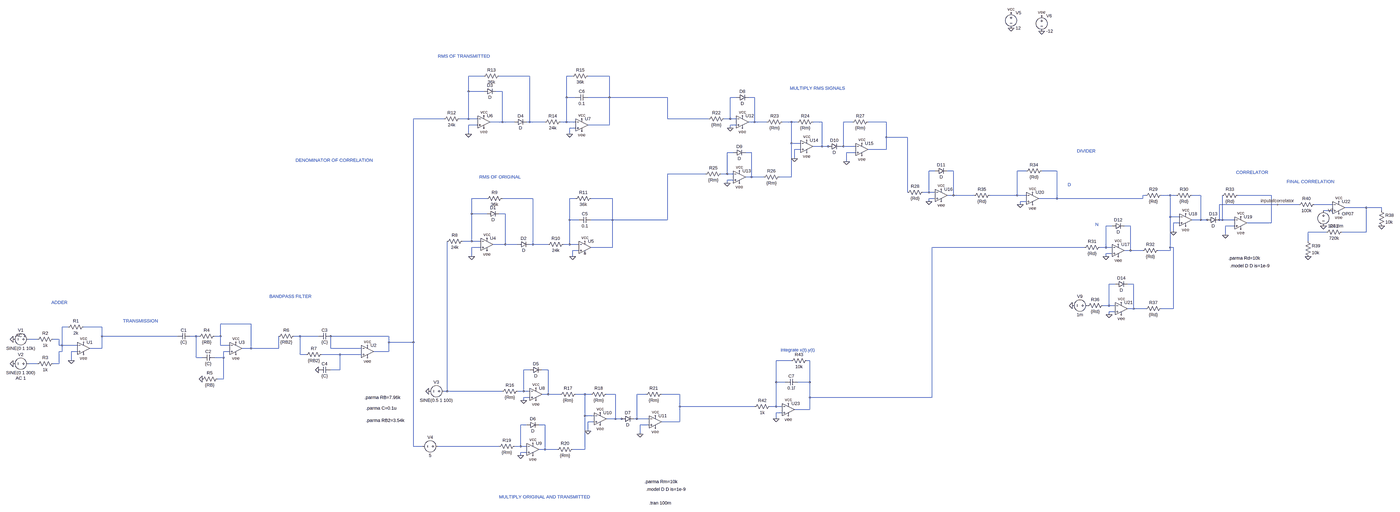
[diagram p0: schematic CORRELATOR BASE.asc, whole sheet]
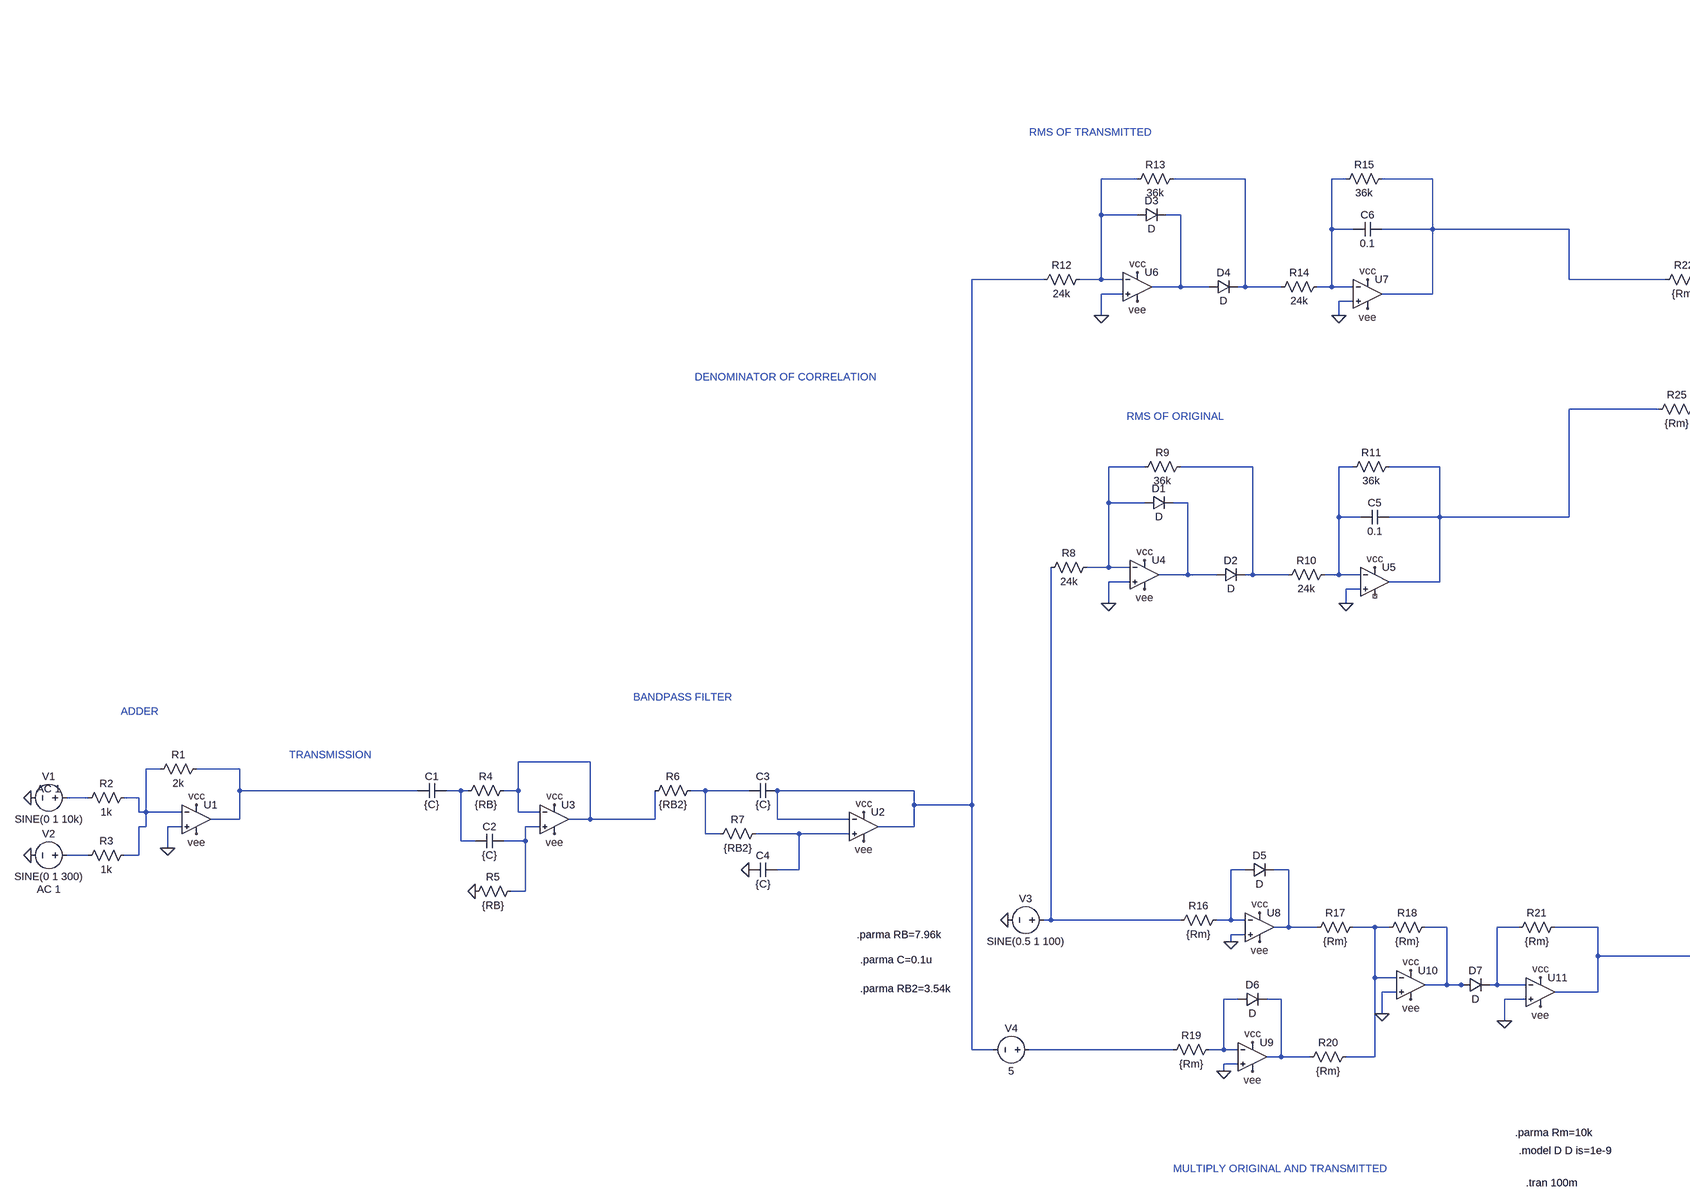
[diagram p1: schematic CORRELATOR BASE.asc, part, row 1 of 1, column 1 of 2]
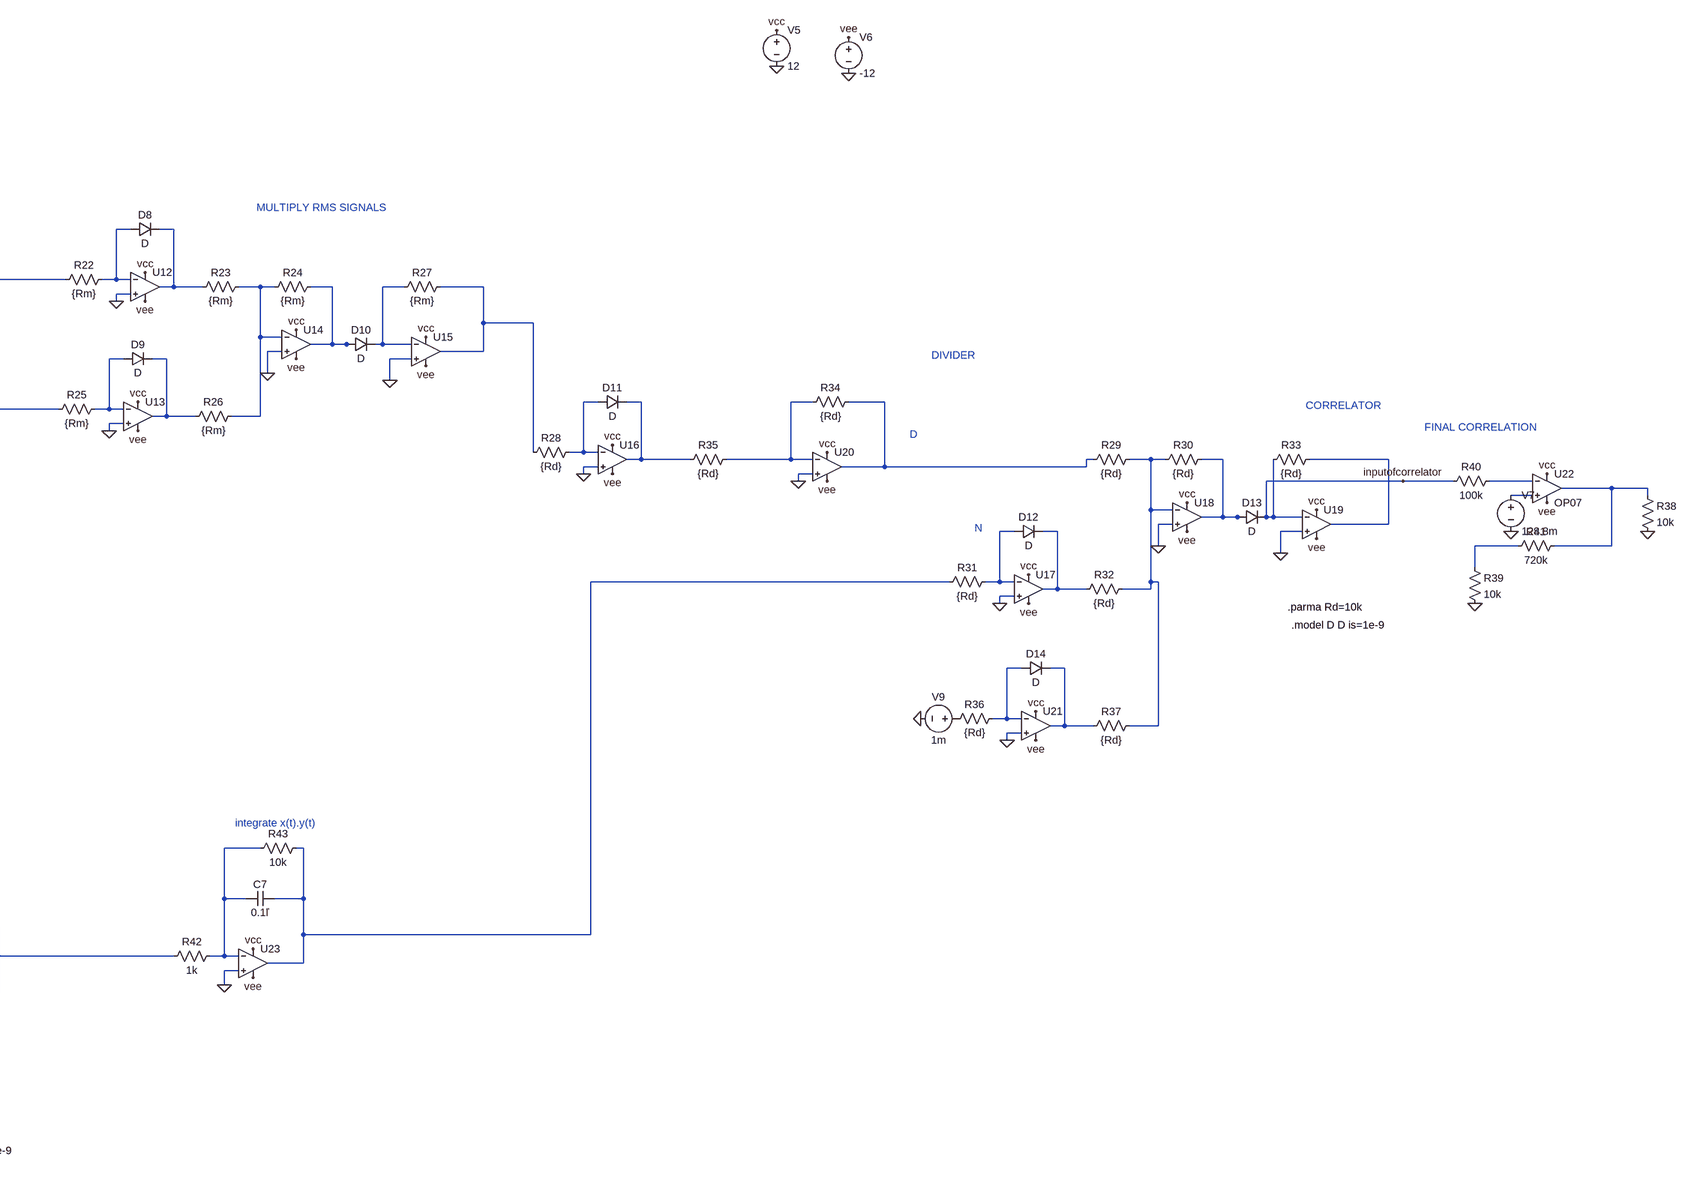
[diagram p2: schematic CORRELATOR BASE.asc, part, row 1 of 1, column 2 of 2]
CORRELATOR BASE.asc, the LTspice schematic file:
Version 4
SHEET 1 8324 1016
WIRE 2640 -1392 2560 -1392
WIRE 2880 -1392 2720 -1392
WIRE 3104 -1392 3072 -1392
WIRE 3296 -1392 3184 -1392
WIRE 2560 -1312 2560 -1392
WIRE 2640 -1312 2560 -1312
WIRE 2736 -1312 2704 -1312
WIRE 3072 -1280 3072 -1392
WIRE 3120 -1280 3072 -1280
WIRE 3296 -1280 3296 -1392
WIRE 3296 -1280 3184 -1280
WIRE 3600 -1280 3296 -1280
WIRE 4064 -1280 4032 -1280
WIRE 4160 -1280 4128 -1280
WIRE 2432 -1168 2272 -1168
WIRE 2560 -1168 2560 -1312
WIRE 2560 -1168 2512 -1168
WIRE 2608 -1168 2560 -1168
WIRE 3600 -1168 3600 -1280
WIRE 3920 -1168 3600 -1168
WIRE 4032 -1168 4032 -1280
WIRE 4032 -1168 4000 -1168
WIRE 4064 -1168 4032 -1168
WIRE 2736 -1152 2736 -1312
WIRE 2736 -1152 2672 -1152
WIRE 2800 -1152 2736 -1152
WIRE 2880 -1152 2880 -1392
WIRE 2880 -1152 2864 -1152
WIRE 2960 -1152 2880 -1152
WIRE 3072 -1152 3072 -1280
WIRE 3072 -1152 3040 -1152
WIRE 3120 -1152 3072 -1152
WIRE 4160 -1152 4160 -1280
WIRE 4160 -1152 4128 -1152
WIRE 4224 -1152 4160 -1152
WIRE 4352 -1152 4304 -1152
WIRE 4384 -1152 4352 -1152
WIRE 4512 -1152 4464 -1152
WIRE 4672 -1152 4624 -1152
WIRE 4848 -1152 4752 -1152
WIRE 2608 -1136 2560 -1136
WIRE 3296 -1136 3296 -1280
WIRE 3296 -1136 3184 -1136
WIRE 4064 -1136 4032 -1136
WIRE 3120 -1120 3088 -1120
WIRE 4032 -1120 4032 -1136
WIRE 2560 -1088 2560 -1136
WIRE 3088 -1088 3088 -1120
WIRE 4848 -1072 4848 -1152
WIRE 5072 -1072 4848 -1072
WIRE 4352 -1040 4352 -1152
WIRE 4400 -1040 4352 -1040
WIRE 4512 -1024 4512 -1152
WIRE 4512 -1024 4464 -1024
WIRE 4544 -1024 4512 -1024
WIRE 4560 -1024 4544 -1024
WIRE 4624 -1024 4624 -1152
WIRE 4624 -1024 4608 -1024
WIRE 4688 -1024 4624 -1024
WIRE 4400 -1008 4368 -1008
WIRE 4848 -1008 4848 -1072
WIRE 4848 -1008 4752 -1008
WIRE 4048 -992 4016 -992
WIRE 4144 -992 4112 -992
WIRE 4688 -992 4640 -992
WIRE 4368 -960 4368 -1008
WIRE 4640 -944 4640 -992
WIRE 5216 -896 5184 -896
WIRE 5312 -896 5280 -896
WIRE 5728 -896 5680 -896
WIRE 5888 -896 5808 -896
WIRE 3904 -880 3600 -880
WIRE 4016 -880 4016 -992
WIRE 4016 -880 3984 -880
WIRE 4048 -880 4016 -880
WIRE 4144 -864 4144 -992
WIRE 4144 -864 4112 -864
WIRE 4208 -864 4144 -864
WIRE 4352 -864 4352 -1040
WIRE 4352 -864 4288 -864
WIRE 4048 -848 4016 -848
WIRE 4016 -832 4016 -848
WIRE 5072 -784 5072 -1072
WIRE 5184 -784 5184 -896
WIRE 5184 -784 5152 -784
WIRE 5216 -784 5184 -784
WIRE 5312 -768 5312 -896
WIRE 5312 -768 5280 -768
WIRE 5456 -768 5312 -768
WIRE 5680 -768 5680 -896
WIRE 5680 -768 5536 -768
WIRE 5728 -768 5680 -768
WIRE 6352 -768 6336 -768
WIRE 6480 -768 6432 -768
WIRE 6512 -768 6480 -768
WIRE 6640 -768 6592 -768
WIRE 7008 -768 6832 -768
WIRE 2656 -752 2576 -752
WIRE 2896 -752 2736 -752
WIRE 3120 -752 3088 -752
WIRE 3312 -752 3200 -752
WIRE 5216 -752 5184 -752
WIRE 5888 -752 5888 -896
WIRE 5888 -752 5792 -752
WIRE 6336 -752 6336 -768
WIRE 6336 -752 5888 -752
WIRE 5184 -736 5184 -752
WIRE 5728 -736 5696 -736
WIRE 5696 -720 5696 -736
WIRE 7040 -720 6736 -720
WIRE 7152 -720 7040 -720
WIRE 7328 -720 7232 -720
WIRE 7504 -704 7392 -704
WIRE 7584 -704 7504 -704
WIRE 7328 -688 7280 -688
WIRE 7584 -688 7584 -704
WIRE 2576 -672 2576 -752
WIRE 2656 -672 2576 -672
WIRE 2752 -672 2720 -672
WIRE 6480 -656 6480 -768
WIRE 6528 -656 6480 -656
WIRE 3088 -640 3088 -752
WIRE 3136 -640 3088 -640
WIRE 3312 -640 3312 -752
WIRE 3312 -640 3200 -640
WIRE 3600 -640 3600 -880
WIRE 3600 -640 3312 -640
WIRE 6640 -640 6640 -768
WIRE 6640 -640 6592 -640
WIRE 6672 -640 6640 -640
WIRE 6688 -640 6672 -640
WIRE 6736 -640 6736 -720
WIRE 6752 -640 6752 -768
WIRE 6752 -640 6736 -640
WIRE 6816 -640 6752 -640
WIRE 6528 -624 6496 -624
WIRE 7008 -624 7008 -768
WIRE 7008 -624 6880 -624
WIRE 6176 -608 6144 -608
WIRE 6272 -608 6240 -608
WIRE 6816 -608 6768 -608
WIRE 6496 -576 6496 -624
WIRE 7296 -576 7200 -576
WIRE 7504 -576 7504 -704
WIRE 7504 -576 7376 -576
WIRE 6768 -560 6768 -608
WIRE 2576 -528 2576 -672
WIRE 2576 -528 2528 -528
WIRE 2624 -528 2576 -528
WIRE 7200 -528 7200 -576
WIRE 2752 -512 2752 -672
WIRE 2752 -512 2688 -512
WIRE 2816 -512 2752 -512
WIRE 2896 -512 2896 -752
WIRE 2896 -512 2880 -512
WIRE 2976 -512 2896 -512
WIRE 3088 -512 3088 -640
WIRE 3088 -512 3056 -512
WIRE 3136 -512 3088 -512
WIRE 2624 -496 2576 -496
WIRE 3312 -496 3312 -640
WIRE 3312 -496 3200 -496
WIRE 6032 -496 5200 -496
WIRE 6144 -496 6144 -608
WIRE 6144 -496 6112 -496
WIRE 6176 -496 6144 -496
WIRE 6480 -496 6480 -656
WIRE 6496 -496 6480 -496
WIRE 3136 -480 3104 -480
WIRE 6272 -480 6272 -608
WIRE 6272 -480 6240 -480
WIRE 6336 -480 6272 -480
WIRE 6480 -480 6480 -496
WIRE 6480 -480 6416 -480
WIRE 6176 -464 6144 -464
WIRE 2576 -448 2576 -496
WIRE 3104 -448 3104 -480
WIRE 6144 -448 6144 -464
WIRE 6192 -304 6160 -304
WIRE 6288 -304 6256 -304
WIRE 6160 -192 6160 -304
WIRE 6160 -192 6128 -192
WIRE 6192 -192 6160 -192
WIRE 6288 -176 6288 -304
WIRE 6288 -176 6256 -176
WIRE 6352 -176 6288 -176
WIRE 6496 -176 6496 -496
WIRE 6496 -176 6432 -176
WIRE 6192 -160 6160 -160
WIRE 6160 -144 6160 -160
WIRE 1424 -96 1264 -96
WIRE 240 -80 208 -80
WIRE 416 -80 320 -80
WIRE 416 -32 416 -80
WIRE 1040 -32 416 -32
WIRE 1136 -32 1104 -32
WIRE 1152 -32 1136 -32
WIRE 1264 -32 1264 -96
WIRE 1264 -32 1232 -32
WIRE 1680 -32 1648 -32
WIRE 1776 -32 1680 -32
WIRE 2144 -32 1840 -32
WIRE 80 -16 32 -16
WIRE 192 -16 160 -16
WIRE 2144 0 2144 -32
WIRE 2272 0 2272 -1168
WIRE 2272 0 2144 0
WIRE 192 16 192 -16
WIRE 208 16 208 -80
WIRE 208 16 192 16
WIRE 288 16 208 16
WIRE 1264 16 1264 -32
WIRE 1312 16 1264 16
WIRE 416 32 416 -32
WIRE 416 32 352 32
WIRE 1424 32 1424 -96
WIRE 1424 32 1376 32
WIRE 1568 32 1568 -32
WIRE 1568 32 1424 32
WIRE 1840 32 1840 -32
WIRE 2000 32 1840 32
WIRE 208 48 208 16
WIRE 208 48 192 48
WIRE 288 48 256 48
WIRE 1312 48 1280 48
WIRE 2144 48 2144 0
WIRE 2144 48 2064 48
WIRE 1680 64 1680 -32
WIRE 1712 64 1680 64
WIRE 1888 64 1792 64
WIRE 2000 64 1888 64
WIRE 1136 80 1136 -32
WIRE 1168 80 1136 80
WIRE 1280 80 1280 48
WIRE 1280 80 1232 80
WIRE 256 96 256 48
WIRE 4352 96 4272 96
WIRE 4448 96 4432 96
WIRE 80 112 32 112
WIRE 192 112 192 48
WIRE 192 112 160 112
WIRE 1888 144 1888 64
WIRE 1888 144 1840 144
WIRE 2880 144 2848 144
WIRE 2976 144 2944 144
WIRE 1280 192 1280 80
WIRE 1280 192 1248 192
WIRE 4272 208 4272 96
WIRE 4320 208 4272 208
WIRE 4448 208 4448 96
WIRE 4448 208 4384 208
WIRE 2448 256 2448 -528
WIRE 2448 256 2432 256
WIRE 2736 256 2448 256
WIRE 2848 256 2848 144
WIRE 2848 256 2816 256
WIRE 2880 256 2848 256
WIRE 2976 272 2976 144
WIRE 2976 272 2944 272
WIRE 3040 272 2976 272
WIRE 3168 272 3120 272
WIRE 3200 272 3168 272
WIRE 3328 272 3280 272
WIRE 3488 272 3440 272
WIRE 3664 272 3568 272
WIRE 2880 288 2848 288
WIRE 4448 288 4448 208
WIRE 5200 288 5200 -496
WIRE 5200 288 4448 288
WIRE 2848 304 2848 288
WIRE 3664 336 3664 272
WIRE 4160 336 3664 336
WIRE 4272 336 4272 208
WIRE 4272 336 4240 336
WIRE 4304 336 4272 336
WIRE 4448 352 4448 288
WIRE 4448 352 4368 352
WIRE 4304 368 4272 368
WIRE 3168 384 3168 272
WIRE 3216 384 3168 384
WIRE 3328 400 3328 272
WIRE 3328 400 3280 400
WIRE 3360 400 3328 400
WIRE 3376 400 3360 400
WIRE 3440 400 3440 272
WIRE 3440 400 3424 400
WIRE 3504 400 3440 400
WIRE 4272 400 4272 368
WIRE 3216 416 3184 416
WIRE 3664 416 3664 336
WIRE 3664 416 3568 416
WIRE 2864 432 2832 432
WIRE 2960 432 2928 432
WIRE 3504 432 3456 432
WIRE 3184 464 3184 416
WIRE 3456 480 3456 432
WIRE 2272 544 2272 0
WIRE 2320 544 2272 544
WIRE 2720 544 2400 544
WIRE 2832 544 2832 432
WIRE 2832 544 2800 544
WIRE 2864 544 2832 544
WIRE 2960 560 2960 432
WIRE 2960 560 2928 560
WIRE 3024 560 2960 560
WIRE 3168 560 3168 384
WIRE 3168 560 3104 560
WIRE 2864 576 2832 576
WIRE 2832 592 2832 576
FLAG 320 0 vcc
FLAG 320 64 vee
FLAG -48 -16 0
FLAG -48 112 0
FLAG 256 96 0
FLAG 2032 16 vcc
FLAG 2032 80 vee
FLAG 1168 192 0
FLAG 1776 144 0
FLAG 1344 0 vcc
FLAG 1344 64 vee
FLAG 2656 -544 vcc
FLAG 2656 -480 vee
FLAG 3168 -528 vcc
FLAG 3104 -448 0
FLAG 2576 -448 0
FLAG 2640 -1184 vcc
FLAG 2640 -1120 vee
FLAG 3152 -1168 vcc
FLAG 3152 -1104 vee
FLAG 3088 -1088 0
FLAG 2560 -1088 0
FLAG 2912 240 vcc
FLAG 2912 304 vee
FLAG 2848 304 0
FLAG 2896 528 vcc
FLAG 2896 592 vee
FLAG 2832 592 0
FLAG 3248 368 vcc
FLAG 3248 432 vee
FLAG 3536 384 vcc
FLAG 3536 448 vee
FLAG 3184 464 0
FLAG 3456 480 0
FLAG 2352 256 0
FLAG 4096 -1184 vcc
FLAG 4096 -1120 vee
FLAG 4032 -1120 0
FLAG 4080 -896 vcc
FLAG 4080 -832 vee
FLAG 4016 -832 0
FLAG 4432 -1056 vcc
FLAG 4432 -992 vee
FLAG 4720 -1040 vcc
FLAG 4720 -976 vee
FLAG 4368 -960 0
FLAG 4640 -944 0
FLAG 5248 -800 vcc
FLAG 5248 -736 vee
FLAG 5184 -736 0
FLAG 6208 -512 vcc
FLAG 6208 -448 vee
FLAG 6144 -448 0
FLAG 6560 -672 vcc
FLAG 6560 -608 vee
FLAG 6848 -656 vcc
FLAG 6848 -592 vee
FLAG 6496 -576 0
FLAG 6768 -560 0
FLAG 5760 -784 vcc
FLAG 5760 -720 vee
FLAG 6224 -208 vcc
FLAG 6224 -144 vee
FLAG 6160 -144 0
FLAG 5968 -192 0
FLAG 7360 -736 vcc
FLAG 7360 -672 vee
FLAG 7200 -448 0
FLAG 7584 -608 0
FLAG 7280 -608 0
FLAG 4336 320 vcc
FLAG 4336 384 vee
FLAG 4272 400 0
FLAG 5696 -720 0
FLAG 7040 -720 inputofcorrelator
FLAG 5648 -1744 0
FLAG 5808 -1728 0
FLAG 5648 -1824 vcc
FLAG 5808 -1808 vee
SYMBOL OpAmps\\UniversalOpAmp 320 32 R0
SYMATTR InstName U1
SYMATTR Value2 Avol=100k GBW=1Meg Vos=0
SYMBOL voltage 48 -16 R90
WINDOW 0 -32 56 VBottom 2
WINDOW 3 32 56 VTop 2
WINDOW 123 -4 56 VBottom 2
WINDOW 39 0 0 Left 0
SYMATTR InstName V1
SYMATTR Value SINE(0 1 10k)
SYMATTR Value2 AC 1
SYMBOL voltage 48 112 R90
WINDOW 0 -32 56 VBottom 2
WINDOW 3 32 56 VTop 2
WINDOW 123 60 56 VTop 2
WINDOW 39 0 0 Left 0
SYMATTR InstName V2
SYMATTR Value SINE(0 1 300)
SYMATTR Value2 AC 1
SYMBOL res 336 -96 R90
WINDOW 0 0 56 VBottom 2
WINDOW 3 32 56 VTop 2
SYMATTR InstName R1
SYMATTR Value 2k
SYMBOL res 176 -32 R90
WINDOW 0 0 56 VBottom 2
WINDOW 3 32 56 VTop 2
SYMATTR InstName R2
SYMATTR Value 1k
SYMBOL res 176 96 R90
WINDOW 0 0 56 VBottom 2
WINDOW 3 32 56 VTop 2
SYMATTR InstName R3
SYMATTR Value 1k
SYMBOL OpAmps\\UniversalOpAmp 2032 48 R0
SYMATTR InstName U2
SYMATTR Value2 Avol=100k GBW=1Meg Vos=0
SYMBOL cap 1104 -48 R90
WINDOW 0 0 32 VBottom 2
WINDOW 3 32 32 VTop 2
SYMATTR InstName C1
SYMATTR Value {C}
SYMBOL cap 1232 64 R90
WINDOW 0 0 32 VBottom 2
WINDOW 3 32 32 VTop 2
SYMATTR InstName C2
SYMATTR Value {C}
SYMBOL cap 1840 -48 R90
WINDOW 0 0 32 VBottom 2
WINDOW 3 32 32 VTop 2
SYMATTR InstName C3
SYMATTR Value {C}
SYMBOL cap 1840 128 R90
WINDOW 0 0 32 VBottom 2
WINDOW 3 32 32 VTop 2
SYMATTR InstName C4
SYMATTR Value {C}
SYMBOL res 1248 -48 R90
WINDOW 0 0 56 VBottom 2
WINDOW 3 32 56 VTop 2
SYMATTR InstName R4
SYMATTR Value {RB}
SYMBOL res 1264 176 R90
WINDOW 0 0 56 VBottom 2
WINDOW 3 32 56 VTop 2
SYMATTR InstName R5
SYMATTR Value {RB}
SYMBOL res 1664 -48 R90
WINDOW 0 0 56 VBottom 2
WINDOW 3 32 56 VTop 2
SYMATTR InstName R6
SYMATTR Value {RB2}
SYMBOL res 1808 48 R90
WINDOW 0 0 56 VBottom 2
WINDOW 3 32 56 VTop 2
SYMATTR InstName R7
SYMATTR Value {RB2}
SYMBOL OpAmps\\UniversalOpAmp 1344 32 R0
SYMATTR InstName U3
SYMATTR Value2 Avol=100k GBW=1Meg Vos=0
SYMBOL OpAmps\\UniversalOpAmp 2656 -512 R0
SYMATTR InstName U4
SYMATTR Value2 Avol=10k GBW=1Meg Vos=0
SYMBOL OpAmps\\UniversalOpAmp 3168 -496 R0
SYMATTR InstName U5
SYMATTR Value2 Avol=10k GBW=1Meg Vos=0
SYMBOL res 2544 -544 R90
WINDOW 0 0 56 VBottom 2
WINDOW 3 32 56 VTop 2
SYMATTR InstName R8
SYMATTR Value 24k
SYMBOL res 2752 -768 R90
WINDOW 0 0 56 VBottom 2
WINDOW 3 32 56 VTop 2
SYMATTR InstName R9
SYMATTR Value 36k
SYMBOL res 3072 -528 R90
WINDOW 0 0 56 VBottom 2
WINDOW 3 32 56 VTop 2
SYMATTR InstName R10
SYMATTR Value 24k
SYMBOL diode 2656 -656 R270
WINDOW 0 32 32 VTop 2
WINDOW 3 0 32 VBottom 2
SYMATTR InstName D1
SYMBOL diode 2816 -496 R270
WINDOW 0 32 32 VTop 2
WINDOW 3 0 32 VBottom 2
SYMATTR InstName D2
SYMBOL cap 3200 -656 R90
WINDOW 0 0 32 VBottom 2
WINDOW 3 32 32 VTop 2
SYMATTR InstName C5
SYMATTR Value 0.1
SYMBOL res 3216 -768 R90
WINDOW 0 0 56 VBottom 2
WINDOW 3 32 56 VTop 2
SYMATTR InstName R11
SYMATTR Value 36k
SYMBOL OpAmps\\UniversalOpAmp 2640 -1152 R0
SYMATTR InstName U6
SYMATTR Value2 Avol=10k GBW=1Meg Vos=0
SYMBOL OpAmps\\UniversalOpAmp 3152 -1136 R0
SYMATTR InstName U7
SYMATTR Value2 Avol=10k GBW=1Meg Vos=0
SYMBOL res 2528 -1184 R90
WINDOW 0 0 56 VBottom 2
WINDOW 3 32 56 VTop 2
SYMATTR InstName R12
SYMATTR Value 24k
SYMBOL res 2736 -1408 R90
WINDOW 0 0 56 VBottom 2
WINDOW 3 32 56 VTop 2
SYMATTR InstName R13
SYMATTR Value 36k
SYMBOL res 3056 -1168 R90
WINDOW 0 0 56 VBottom 2
WINDOW 3 32 56 VTop 2
SYMATTR InstName R14
SYMATTR Value 24k
SYMBOL diode 2640 -1296 R270
WINDOW 0 32 32 VTop 2
WINDOW 3 0 32 VBottom 2
SYMATTR InstName D3
SYMBOL diode 2800 -1136 R270
WINDOW 0 32 32 VTop 2
WINDOW 3 0 32 VBottom 2
SYMATTR InstName D4
SYMBOL cap 3184 -1296 R90
WINDOW 0 0 32 VBottom 2
WINDOW 3 32 32 VTop 2
SYMATTR InstName C6
SYMATTR Value 0.1
SYMBOL res 3200 -1408 R90
WINDOW 0 0 56 VBottom 2
WINDOW 3 32 56 VTop 2
SYMATTR InstName R15
SYMATTR Value 36k
SYMBOL OpAmps\\UniversalOpAmp 2912 272 R0
SYMATTR InstName U8
SYMATTR Value2 Avol=100k GBW=1Meg Vos=0
SYMBOL res 2832 240 R90
WINDOW 0 0 56 VBottom 2
WINDOW 3 32 56 VTop 2
SYMATTR InstName R16
SYMATTR Value {Rm}
SYMBOL res 3136 256 R90
WINDOW 0 0 56 VBottom 2
WINDOW 3 32 56 VTop 2
SYMATTR InstName R17
SYMATTR Value {Rm}
SYMBOL res 3296 256 R90
WINDOW 0 0 56 VBottom 2
WINDOW 3 32 56 VTop 2
SYMATTR InstName R18
SYMATTR Value {Rm}
SYMBOL diode 2880 160 R270
WINDOW 0 32 32 VTop 2
WINDOW 3 0 32 VBottom 2
SYMATTR InstName D5
SYMBOL OpAmps\\UniversalOpAmp 2896 560 R0
SYMATTR InstName U9
SYMATTR Value2 Avol=100k GBW=1Meg Vos=0
SYMBOL res 2816 528 R90
WINDOW 0 0 56 VBottom 2
WINDOW 3 32 56 VTop 2
SYMATTR InstName R19
SYMATTR Value {Rm}
SYMBOL res 3120 544 R90
WINDOW 0 0 56 VBottom 2
WINDOW 3 32 56 VTop 2
SYMATTR InstName R20
SYMATTR Value {Rm}
SYMBOL diode 2864 448 R270
WINDOW 0 32 32 VTop 2
WINDOW 3 0 32 VBottom 2
SYMATTR InstName D6
SYMBOL OpAmps\\UniversalOpAmp 3248 400 R0
SYMATTR InstName U10
SYMATTR Value2 Avol=100k GBW=1Meg Vos=0
SYMBOL diode 3360 416 R270
WINDOW 0 32 32 VTop 2
WINDOW 3 0 32 VBottom 2
SYMATTR InstName D7
SYMBOL OpAmps\\UniversalOpAmp 3536 416 R0
SYMATTR InstName U11
SYMATTR Value2 Avol=100k GBW=1Meg Vos=0
SYMBOL res 3584 256 R90
WINDOW 0 0 56 VBottom 2
WINDOW 3 32 56 VTop 2
SYMATTR InstName R21
SYMATTR Value {Rm}
SYMBOL voltage 2448 256 R90
WINDOW 0 -32 56 VBottom 2
WINDOW 3 32 56 VTop 2
WINDOW 123 0 0 Left 0
WINDOW 39 0 0 Left 0
SYMATTR InstName V3
SYMATTR Value SINE(0.5 1 100)
SYMBOL OpAmps\\UniversalOpAmp 4096 -1152 R0
SYMATTR InstName U12
SYMATTR Value2 Avol=100k GBW=1Meg Vos=0
SYMBOL res 4016 -1184 R90
WINDOW 0 0 56 VBottom 2
WINDOW 3 32 56 VTop 2
SYMATTR InstName R22
SYMATTR Value {Rm}
SYMBOL res 4320 -1168 R90
WINDOW 0 0 56 VBottom 2
WINDOW 3 32 56 VTop 2
SYMATTR InstName R23
SYMATTR Value {Rm}
SYMBOL res 4480 -1168 R90
WINDOW 0 0 56 VBottom 2
WINDOW 3 32 56 VTop 2
SYMATTR InstName R24
SYMATTR Value {Rm}
SYMBOL diode 4064 -1264 R270
WINDOW 0 32 32 VTop 2
WINDOW 3 0 32 VBottom 2
SYMATTR InstName D8
SYMBOL OpAmps\\UniversalOpAmp 4080 -864 R0
SYMATTR InstName U13
SYMATTR Value2 Avol=100k GBW=1Meg Vos=0
SYMBOL res 4000 -896 R90
WINDOW 0 0 56 VBottom 2
WINDOW 3 32 56 VTop 2
SYMATTR InstName R25
SYMATTR Value {Rm}
SYMBOL res 4304 -880 R90
WINDOW 0 0 56 VBottom 2
WINDOW 3 32 56 VTop 2
SYMATTR InstName R26
SYMATTR Value {Rm}
SYMBOL diode 4048 -976 R270
WINDOW 0 32 32 VTop 2
WINDOW 3 0 32 VBottom 2
SYMATTR InstName D9
SYMBOL OpAmps\\UniversalOpAmp 4432 -1024 R0
SYMATTR InstName U14
SYMATTR Value2 Avol=100k GBW=1Meg Vos=0
SYMBOL diode 4544 -1008 R270
WINDOW 0 32 32 VTop 2
WINDOW 3 0 32 VBottom 2
SYMATTR InstName D10
SYMBOL OpAmps\\UniversalOpAmp 4720 -1008 R0
SYMATTR InstName U15
SYMATTR Value2 Avol=100k GBW=1Meg Vos=0
SYMBOL res 4768 -1168 R90
WINDOW 0 0 56 VBottom 2
WINDOW 3 32 56 VTop 2
SYMATTR InstName R27
SYMATTR Value {Rm}
SYMBOL OpAmps\\UniversalOpAmp 5248 -768 R0
SYMATTR InstName U16
SYMATTR Value2 Avol=100k GBW=1Meg Vos=0
SYMBOL res 5168 -800 R90
WINDOW 0 0 56 VBottom 2
WINDOW 3 32 56 VTop 2
SYMATTR InstName R28
SYMATTR Value {Rd}
SYMBOL res 6448 -784 R90
WINDOW 0 0 56 VBottom 2
WINDOW 3 32 56 VTop 2
SYMATTR InstName R29
SYMATTR Value {Rd}
SYMBOL res 6608 -784 R90
WINDOW 0 0 56 VBottom 2
WINDOW 3 32 56 VTop 2
SYMATTR InstName R30
SYMATTR Value {Rd}
SYMBOL diode 5216 -880 R270
WINDOW 0 32 32 VTop 2
WINDOW 3 0 32 VBottom 2
SYMATTR InstName D11
SYMBOL OpAmps\\UniversalOpAmp 6208 -480 R0
SYMATTR InstName U17
SYMATTR Value2 Avol=100k GBW=1Meg Vos=0
SYMBOL res 6128 -512 R90
WINDOW 0 0 56 VBottom 2
WINDOW 3 32 56 VTop 2
SYMATTR InstName R31
SYMATTR Value {Rd}
SYMBOL res 6432 -496 R90
WINDOW 0 0 56 VBottom 2
WINDOW 3 32 56 VTop 2
SYMATTR InstName R32
SYMATTR Value {Rd}
SYMBOL diode 6176 -592 R270
WINDOW 0 32 32 VTop 2
WINDOW 3 0 32 VBottom 2
SYMATTR InstName D12
SYMBOL OpAmps\\UniversalOpAmp 6560 -640 R0
SYMATTR InstName U18
SYMATTR Value2 Avol=100k GBW=1Meg Vos=0
SYMBOL diode 6672 -624 R270
WINDOW 0 32 32 VTop 2
WINDOW 3 0 32 VBottom 2
SYMATTR InstName D13
SYMBOL OpAmps\\UniversalOpAmp 6848 -624 R0
SYMATTR InstName U19
SYMATTR Value2 Avol=100k GBW=1Meg Vos=0
SYMBOL res 6848 -784 R90
WINDOW 0 0 56 VBottom 2
WINDOW 3 32 56 VTop 2
SYMATTR InstName R33
SYMATTR Value {Rd}
SYMBOL OpAmps\\UniversalOpAmp 5760 -752 R0
SYMATTR InstName U20
SYMATTR Value2 Avol=100k GBW=1Meg Vos=0
SYMBOL res 5824 -912 R90
WINDOW 0 0 56 VBottom 2
WINDOW 3 32 56 VTop 2
SYMATTR InstName R34
SYMATTR Value {Rd}
SYMBOL res 5552 -784 R90
WINDOW 0 0 56 VBottom 2
WINDOW 3 32 56 VTop 2
SYMATTR InstName R35
SYMATTR Value {Rd}
SYMBOL OpAmps\\UniversalOpAmp 6224 -176 R0
SYMATTR InstName U21
SYMATTR Value2 Avol=100k GBW=1Meg Vos=0
SYMBOL res 6144 -208 R90
WINDOW 0 0 56 VBottom 2
WINDOW 3 32 56 VTop 2
SYMATTR InstName R36
SYMATTR Value {Rd}
SYMBOL res 6448 -192 R90
WINDOW 0 0 56 VBottom 2
WINDOW 3 32 56 VTop 2
SYMATTR InstName R37
SYMATTR Value {Rd}
SYMBOL diode 6192 -288 R270
WINDOW 0 32 32 VTop 2
WINDOW 3 0 32 VBottom 2
SYMATTR InstName D14
SYMBOL voltage 6064 -192 R90
WINDOW 0 -32 56 VBottom 2
WINDOW 3 32 56 VTop 2
WINDOW 123 0 0 Left 0
WINDOW 39 0 0 Left 0
SYMATTR InstName V9
SYMATTR Value 1m
SYMBOL res 7568 -704 R0
SYMATTR InstName R38
SYMATTR Value 10k
SYMBOL res 7184 -544 R0
SYMATTR InstName R39
SYMATTR Value 10k
SYMBOL res 7248 -736 R90
WINDOW 0 0 56 VBottom 2
WINDOW 3 32 56 VTop 2
SYMATTR InstName R40
SYMATTR Value 100k
SYMBOL res 7392 -592 R90
WINDOW 0 0 56 VBottom 2
WINDOW 3 32 56 VTop 2
SYMATTR InstName R41
SYMATTR Value 720k
SYMBOL res 4256 320 R90
WINDOW 0 0 56 VBottom 2
WINDOW 3 32 56 VTop 2
SYMATTR InstName R42
SYMATTR Value 1k
SYMBOL cap 4384 192 R90
WINDOW 0 0 32 VBottom 2
WINDOW 3 32 32 VTop 2
SYMATTR InstName C7
SYMATTR Value 0.1ľ
SYMBOL OpAmps\\UniversalOpAmp 4336 352 R0
SYMATTR InstName U23
SYMATTR Value2 Avol=10k GBW=1Meg Vos=0
SYMBOL res 4448 80 R90
WINDOW 0 0 56 VBottom 2
WINDOW 3 32 56 VTop 2
SYMATTR InstName R43
SYMATTR Value 10k
SYMBOL voltage 2416 544 R90
WINDOW 0 -32 56 VBottom 2
WINDOW 3 32 56 VTop 2
WINDOW 123 0 0 Left 0
WINDOW 39 0 0 Left 0
SYMATTR InstName V4
SYMATTR Value 5
SYMBOL voltage 5648 -1840 R0
WINDOW 123 0 0 Left 0
WINDOW 39 0 0 Left 0
SYMATTR InstName V5
SYMATTR Value 12
SYMBOL voltage 5808 -1824 R0
WINDOW 123 0 0 Left 0
WINDOW 39 0 0 Left 0
SYMATTR InstName V6
SYMATTR Value -12
SYMBOL OpAmps\\OP07 7360 -768 R0
SYMATTR InstName U22
SYMBOL voltage 7280 -704 R0
WINDOW 123 0 0 Left 0
WINDOW 39 0 0 Left 0
SYMATTR InstName V7
SYMATTR Value 128.8m
TEXT 152 -208 Left 2 ;ADDER
TEXT 2016 288 Left 2 !.parma RB=7.96k
TEXT 2024 344 Left 2 !.parma C=0.1u
TEXT 2024 408 Left 2 !.parma RB2=3.54k
TEXT 648 -112 Left 2 ;TRANSMISSION
TEXT 1520 -240 Left 2 ;BANDPASS FILTER
TEXT 3480 728 Left 2 !.parma Rm=10k
TEXT 3504 840 Left 2 !.tran 100m
TEXT 3488 768 Left 2 !.model D D is=1e-9
TEXT 2616 -864 Left 2 ;RMS OF ORIGINAL
TEXT 2400 -1496 Left 2 ;RMS OF TRANSMITTED
TEXT 2720 808 Left 2 ;MULTIPLY ORIGINAL AND TRANSMITTED
TEXT 1656 -952 Left 2 ;DENOMINATOR OF CORRELATION
TEXT 6784 -440 Left 2 !.parma Rd=10k
TEXT 6792 -400 Left 2 !.model D D is=1e-9
TEXT 4344 -1328 Left 2 ;MULTIPLY RMS SIGNALS
TEXT 5992 -1000 Left 2 ;DIVIDER
TEXT 7088 -840 Left 2 ;FINAL CORRELATION
TEXT 6824 -888 Left 2 ;CORRELATOR
TEXT 5944 -824 Left 2 ;D
TEXT 6088 -616 Left 2 ;N
TEXT 4296 40 Left 2 ;integrate x(t).y(t)

The netlist it stands for:
* CORRELATOR BASE.asc
XU1 0 N037 vcc vee N038 level1 Avol=100k GBW=1Meg Vos=0 En=0 Enk=0 In=0 Ink=0 Rin=500Meg  ; pins In+ In- V+ V- OUT
V1 N041 0 SINE(0 1 10k) AC 1
V2 N045 0 SINE(0 1 300) AC 1
R1 N038 N037 2k
R2 N037 N041 1k
R3 N037 N045 1k
XU2 N043 N008 vcc vee N008 level1 Avol=100k GBW=1Meg Vos=0 En=0 Enk=0 In=0 Ink=0 Rin=500Meg  ; pins In+ In- V+ V- OUT
C1 N039 N038 {C}
C2 N042 N039 {C}
C3 N008 N040 {C}
C4 N043 0 {C}
R4 N036 N039 {RB}
R5 N042 0 {RB}
R6 N040 N036 {RB2}
R7 N043 N040 {RB2}
XU3 N042 N036 vcc vee N036 level1 Avol=100k GBW=1Meg Vos=0 En=0 Enk=0 In=0 Ink=0 Rin=500Meg  ; pins In+ In- V+ V- OUT
XU4 0 N023 vcc vee N029 level1 Avol=10k GBW=1Meg Vos=0 En=0 Enk=0 In=0 Ink=0 Rin=500Meg  ; pins In+ In- V+ V- OUT
XU5 0 N025 vcc NC_01 N019 level1 Avol=10k GBW=1Meg Vos=0 En=0 Enk=0 In=0 Ink=0 Rin=500Meg  ; pins In+ In- V+ V- OUT
R8 N023 N048 24k
R9 N024 N023 36k
R10 N025 N024 24k
D1 N023 N029 D
D2 N029 N024 D
C5 N019 N025 0.1
R11 N019 N025 36k
XU6 0 N001 vcc vee N005 level1 Avol=10k GBW=1Meg Vos=0 En=0 Enk=0 In=0 Ink=0 Rin=500Meg  ; pins In+ In- V+ V- OUT
XU7 0 N003 vcc vee N004 level1 Avol=10k GBW=1Meg Vos=0 En=0 Enk=0 In=0 Ink=0 Rin=500Meg  ; pins In+ In- V+ V- OUT
R12 N001 N008 24k
R13 N002 N001 36k
R14 N003 N002 24k
D3 N001 N005 D
D4 N005 N002 D
C6 N004 N003 0.1
R15 N004 N003 36k
XU8 0 N046 vcc vee N047 level1 Avol=100k GBW=1Meg Vos=0 En=0 Enk=0 In=0 Ink=0 Rin=500Meg  ; pins In+ In- V+ V- OUT
R16 N046 N048 {Rm}
R17 N049 N047 {Rm}
R18 N050 N049 {Rm}
D5 N046 N047 D
XU9 0 N053 vcc vee N054 level1 Avol=100k GBW=1Meg Vos=0 En=0 Enk=0 In=0 Ink=0 Rin=500Meg  ; pins In+ In- V+ V- OUT
R19 N053 N055 {Rm}
R20 N049 N054 {Rm}
D6 N053 N054 D
XU10 0 N049 vcc vee N050 level1 Avol=100k GBW=1Meg Vos=0 En=0 Enk=0 In=0 Ink=0 Rin=500Meg  ; pins In+ In- V+ V- OUT
D7 N050 N051 D
XU11 0 N051 vcc vee N052 level1 Avol=100k GBW=1Meg Vos=0 En=0 Enk=0 In=0 Ink=0 Rin=500Meg  ; pins In+ In- V+ V- OUT
R21 N052 N051 {Rm}
V3 N048 0 SINE(0.5 1 100)
XU12 0 N006 vcc vee N007 level1 Avol=100k GBW=1Meg Vos=0 En=0 Enk=0 In=0 Ink=0 Rin=500Meg  ; pins In+ In- V+ V- OUT
R22 N006 N004 {Rm}
R23 N009 N007 {Rm}
R24 N010 N009 {Rm}
D8 N006 N007 D
XU13 0 N013 vcc vee N014 level1 Avol=100k GBW=1Meg Vos=0 En=0 Enk=0 In=0 Ink=0 Rin=500Meg  ; pins In+ In- V+ V- OUT
R25 N013 N019 {Rm}
R26 N009 N014 {Rm}
D9 N013 N014 D
XU14 0 N009 vcc vee N010 level1 Avol=100k GBW=1Meg Vos=0 En=0 Enk=0 In=0 Ink=0 Rin=500Meg  ; pins In+ In- V+ V- OUT
D10 N010 N011 D
XU15 0 N011 vcc vee N012 level1 Avol=100k GBW=1Meg Vos=0 En=0 Enk=0 In=0 Ink=0 Rin=500Meg  ; pins In+ In- V+ V- OUT
R27 N012 N011 {Rm}
XU16 0 N015 vcc vee N016 level1 Avol=100k GBW=1Meg Vos=0 En=0 Enk=0 In=0 Ink=0 Rin=500Meg  ; pins In+ In- V+ V- OUT
R28 N015 N012 {Rd}
R29 N020 N018 {Rd}
R30 N021 N020 {Rd}
D11 N015 N016 D
XU17 0 N030 vcc vee N031 level1 Avol=100k GBW=1Meg Vos=0 En=0 Enk=0 In=0 Ink=0 Rin=500Meg  ; pins In+ In- V+ V- OUT
R31 N030 N033 {Rd}
R32 N020 N031 {Rd}
D12 N030 N031 D
XU18 0 N020 vcc vee N021 level1 Avol=100k GBW=1Meg Vos=0 En=0 Enk=0 In=0 Ink=0 Rin=500Meg  ; pins In+ In- V+ V- OUT
D13 N021 inputofcorrelator D
XU19 0 inputofcorrelator vcc vee N022 level1 Avol=100k GBW=1Meg Vos=0 En=0 Enk=0 In=0 Ink=0 Rin=500Meg  ; pins In+ In- V+ V- OUT
R33 N022 inputofcorrelator {Rd}
XU20 0 N017 vcc vee N018 level1 Avol=100k GBW=1Meg Vos=0 En=0 Enk=0 In=0 Ink=0 Rin=500Meg  ; pins In+ In- V+ V- OUT
R34 N018 N017 {Rd}
R35 N017 N016 {Rd}
XU21 0 N034 vcc vee N035 level1 Avol=100k GBW=1Meg Vos=0 En=0 Enk=0 In=0 Ink=0 Rin=500Meg  ; pins In+ In- V+ V- OUT
R36 N034 P001 {Rd}
R37 N020 N035 {Rd}
D14 N034 N035 D
V9 P001 0 1m
R38 N027 0 10k
R39 N032 0 10k
R40 N026 inputofcorrelator 100k
R41 N027 N032 720k
R42 N044 N052 1k
C7 N033 N044 0.1ľ
XU23 0 N044 vcc vee N033 level1 Avol=10k GBW=1Meg Vos=0 En=0 Enk=0 In=0 Ink=0 Rin=500Meg  ; pins In+ In- V+ V- OUT
R43 N033 N044 10k
V4 N055 N008 5
V5 vcc 0 12
V6 vee 0 -12
XU22 N028 N026 vcc vee N027 LT1001  ; OP07, pins In+ In- V+ V- OUT
V7 N028 0 128.8m
.model D D
.lib standard.dio
* ADDER
.parma RB=7.96k
.parma C=0.1u
.parma RB2=3.54k
* TRANSMISSION
* BANDPASS FILTER
.parma Rm=10k
.tran 100m
.model D D is=1e-9
* RMS OF ORIGINAL
* RMS OF TRANSMITTED
* MULTIPLY ORIGINAL AND TRANSMITTED
* DENOMINATOR OF CORRELATION
.parma Rd=10k
.model D D is=1e-9
* MULTIPLY RMS SIGNALS
* DIVIDER
* FINAL CORRELATION
* CORRELATOR
* D
* N
* integrate x(t).y(t)
.lib UniversalOpAmp1.lib
.lib LTC.lib
.backanno
.end